# Altium schematic sheet Amplifier_For_Term.SchDoc
size A4
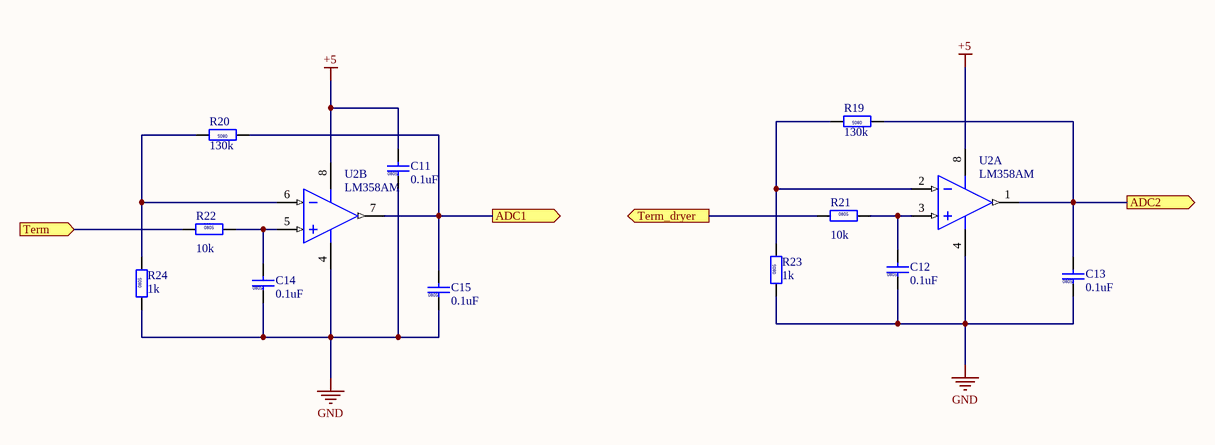
[diagram p0: Amplifier_For_Term.SchDoc]

## Parts
C11  value 0.1uF  [CAPC2012-0805M]  (hidden comment: CAPC_0805)
C12  value 0.1uF  [CAPC2012-0805M]  (hidden comment: CAPC_0805)
C13  value 0.1uF  [CAPC2012-0805M]  (hidden comment: CAPC_0805)
C14  value 0.1uF  [CAPC2012-0805M]  (hidden comment: CAPC_0805)
C15  value 0.1uF  [CAPC2012-0805M]  (hidden comment: CAPC_0805)
R19  value 130k  [RESC2012-0805M]  (hidden comment: RESC_0805_R)
R20  value 130k  [RESC2012-0805M]  (hidden comment: RESC_0805_R)
R21  value 10k  [RESC2012-0805M]  (hidden comment: RESC_0805_R)
R22  value 10k  [RESC2012-0805M]  (hidden comment: RESC_0805_R)
R23  value 1k  [RESC2012-0805M]  (hidden comment: RESC_0805_R)
R24  value 1k  [RESC2012-0805M]  (hidden comment: RESC_0805_R)
U2  LM358AM  [SO-8_L]  (parts A,B of 2)

## Ports
ADC1 (out), ADC2 (out), Term (in), Term_dryer (out)

## Nets
+5: C11.2 U2.8(V+)
GND: C11.1 C12.1 C13.1 C14.1 C15.1 R23.1 R24.1 U2.4(GND)
ADC1: C15.2 R20.1 U2.7(OUTB) ; port ADC1
ADC2: C13.2 R19.1 U2.1(OUTA) ; port ADC2
Term: R22.1 ; port Term
Term_dryer: R21.1 ; port Term_dryer
NetC12_2: C12.2 R21.2 U2.3(INA+)
NetC14_2: C14.2 R22.2 U2.5(INB+)
NetR19_2: R19.2 R23.2 U2.2(INA-)
NetR20_2: R20.2 R24.2 U2.6(INB-)

## Notes on the sheet
- (in symbol CAPC_0805) 0805
- (in symbol RESC_0805_R) 0805

## Library data of the parts
C11-C15 = CAPC_0805: Capacitor 0805
R19-R24 = RESC_0805_R: Resistor 0805
U2 = LM358AM: Low Power Dual Operational Amplifier; Manufacturer: National Semiconductor; CompType: Amplifiers; PackageTopMarking: NSZXTT*LM*358AM; PowerWise: N; Published: 4-Dec-2008; LatestRevisionDate: 13-Jan-2009; LatestRevisionNote: Sim Model Added.; DatasheetVersion: Oct-2005; PackageVersion: revL, Sep-2006; PackageReference: M08A; Publisher: Altium Limited; PackageDescription: SOIC Narrow, 4.9 x 3.9 x 1.45mm, 8 Lead, 1.27mm Pitch; PartNumber: LM358AM; RoHS: O; PinCount: 8; DigiKeyPartNumber: LM358AMXCT-ND; Code_JEDEC: MS-012-AA; Code_IPC: SOIC127P600-8; ComponentLink1Description: LM358 Datasheet; ComponentLink1URL: http://www.national.com/ds/LM/LM358.pdf; ComponentLink2Description: LM358 Web Page; ComponentLink2URL: http://www.national.com/pf/LM/LM358.html; ComponentLink3Description: M08A Package Page; ComponentLink3URL: http://www.national.com/packaging/folders/m08a.html